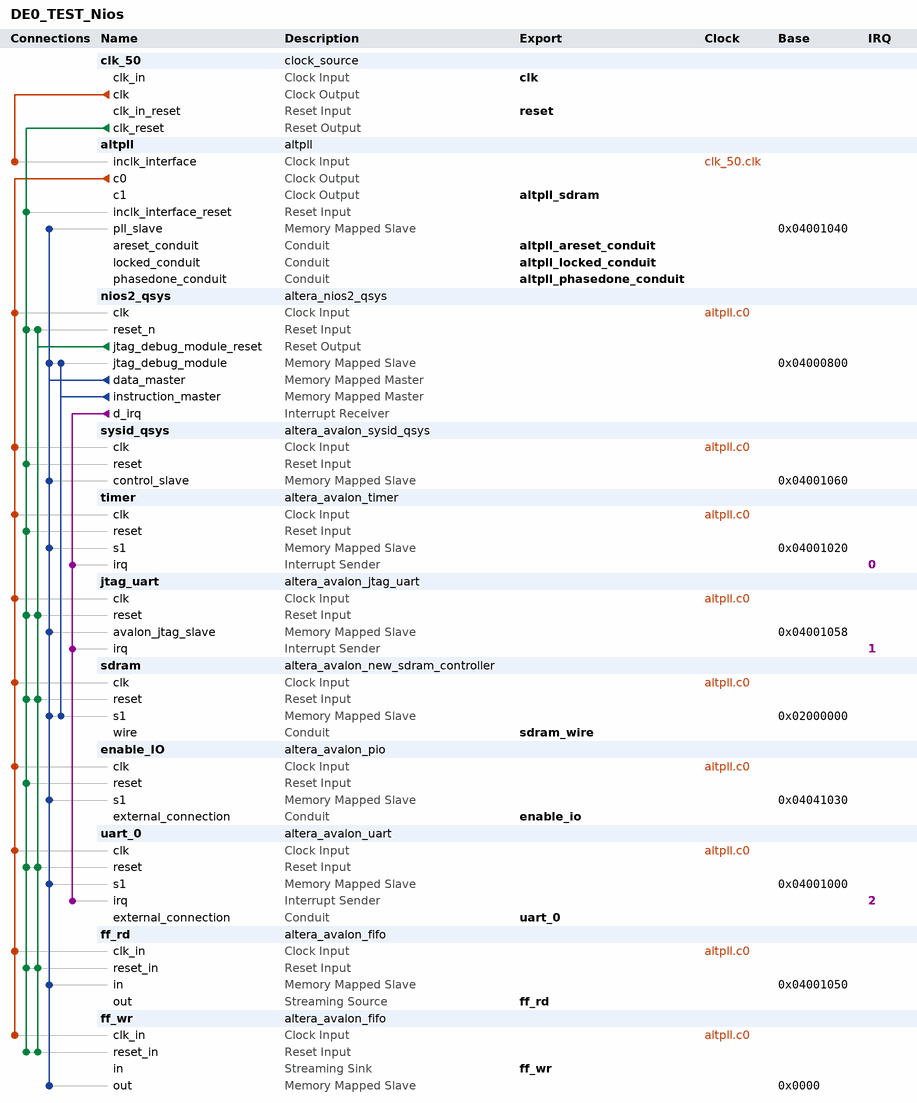
[diagram p0: system contents]
# Platform Designer (Qsys) system DE0_TEST_Nios, Cyclone IV E EP4CE22F17C6
# Parameters at their usual value, and those the tool derives, are not listed.
package require -exact qsys 13.0.1.99.2
create_system DE0_TEST_Nios
set_project_property DEVICE_FAMILY {Cyclone IV E}
set_project_property DEVICE EP4CE22F17C6

add_instance clk_50 clock_source 13.0
set_instance_parameter_value clk_50 clockFrequency 50000000

add_instance altpll altpll 13.0
set_instance_parameter_value altpll INCLK0_INPUT_FREQUENCY 20000
set_instance_parameter_value altpll CLK0_MULTIPLY_BY 2
set_instance_parameter_value altpll CLK1_MULTIPLY_BY 2
set_instance_parameter_value altpll CLK0_DIVIDE_BY 1
set_instance_parameter_value altpll CLK1_DIVIDE_BY 1
set_instance_parameter_value altpll CLK1_PHASE_SHIFT -1667
set_instance_parameter_value altpll CLK1_DUTY_CYCLE 50
set_instance_parameter_value altpll PORT_clk1 PORT_USED
set_instance_parameter_value altpll PORT_clk2 PORT_UNUSED
set_instance_parameter_value altpll PORT_clk3 PORT_UNUSED
set_instance_parameter_value altpll PORT_ARESET PORT_USED
set_instance_parameter_value altpll PORT_LOCKED PORT_USED

add_instance nios2_qsys altera_nios2_qsys 13.0
set_instance_parameter_value nios2_qsys resetSlave sdram.s1
set_instance_parameter_value nios2_qsys mmu_TLBMissExcSlave None
set_instance_parameter_value nios2_qsys exceptionSlave sdram.s1
set_instance_parameter_value nios2_qsys breakSlave nios2_qsys.jtag_debug_module
set_instance_parameter_value nios2_qsys impl Fast
set_instance_parameter_value nios2_qsys icache_size 4096

add_instance sysid_qsys altera_avalon_sysid_qsys 13.0
set_instance_parameter_value sysid_qsys id 0

add_instance timer altera_avalon_timer 13.0.1.99.2
set_instance_parameter_value timer period 1
set_instance_parameter_value timer periodUnits MSEC

add_instance jtag_uart altera_avalon_jtag_uart 13.0.1.99.2
set_instance_parameter_value jtag_uart simInteractiveOptions NO_INTERACTIVE_WINDOWS

add_instance sdram altera_avalon_new_sdram_controller 13.0.1.99.2
set_instance_parameter_value sdram TAC 5.5
set_instance_parameter_value sdram TRCD 20.0
set_instance_parameter_value sdram TRP 20.0
set_instance_parameter_value sdram casLatency 3
set_instance_parameter_value sdram columnWidth 9
set_instance_parameter_value sdram dataWidth 16
set_instance_parameter_value sdram generateSimulationModel true
set_instance_parameter_value sdram model single_Micron_MT48LC4M32B2_7_chip
set_instance_parameter_value sdram numberOfBanks 4
set_instance_parameter_value sdram numberOfChipSelects 1
set_instance_parameter_value sdram powerUpDelay 100.0
set_instance_parameter_value sdram refreshPeriod 15.625
set_instance_parameter_value sdram rowWidth 13

add_instance enable_IO altera_avalon_pio 13.0.1.99.2
set_instance_parameter_value enable_IO captureEdge true
set_instance_parameter_value enable_IO direction Output
set_instance_parameter_value enable_IO edgeType FALLING
set_instance_parameter_value enable_IO generateIRQ true
set_instance_parameter_value enable_IO irqType EDGE
set_instance_parameter_value enable_IO width 32

add_instance uart_0 altera_avalon_uart 13.0.1.99.2
set_instance_parameter_value uart_0 baud 115200
set_instance_parameter_value uart_0 dataBits 8
set_instance_parameter_value uart_0 fixedBaud true
set_instance_parameter_value uart_0 parity NONE
set_instance_parameter_value uart_0 stopBits 1

add_instance ff_rd altera_avalon_fifo 13.0.1.99.2
set_instance_parameter_value ff_rd bitsPerSymbol 32
set_instance_parameter_value ff_rd channelWidth 8
set_instance_parameter_value ff_rd errorWidth 8
set_instance_parameter_value ff_rd fifoDepth 32
set_instance_parameter_value ff_rd fifoInputInterfaceOptions AVALONMM_WRITE
set_instance_parameter_value ff_rd fifoOutputInterfaceOptions AVALONST_SOURCE
set_instance_parameter_value ff_rd singleClockMode true
set_instance_parameter_value ff_rd singleResetMode true
set_instance_parameter_value ff_rd symbolsPerBeat 1
set_instance_parameter_value ff_rd useIRQ false
set_instance_parameter_value ff_rd usePacket true
set_instance_parameter_value ff_rd useReadControl false
set_instance_parameter_value ff_rd useWriteControl false

add_instance ff_wr altera_avalon_fifo 13.0.1.99.2
set_instance_parameter_value ff_wr bitsPerSymbol 32
set_instance_parameter_value ff_wr channelWidth 8
set_instance_parameter_value ff_wr errorWidth 8
set_instance_parameter_value ff_wr fifoDepth 32
set_instance_parameter_value ff_wr fifoInputInterfaceOptions AVALONST_SINK
set_instance_parameter_value ff_wr fifoOutputInterfaceOptions AVALONMM_READ
set_instance_parameter_value ff_wr singleClockMode true
set_instance_parameter_value ff_wr singleResetMode true
set_instance_parameter_value ff_wr symbolsPerBeat 1
set_instance_parameter_value ff_wr useIRQ false
set_instance_parameter_value ff_wr usePacket true
set_instance_parameter_value ff_wr useReadControl false
set_instance_parameter_value ff_wr useWriteControl false

# connections
add_connection altpll.c0 enable_IO.clk clock
add_connection altpll.c0 ff_rd.clk_in clock
add_connection altpll.c0 ff_wr.clk_in clock
add_connection altpll.c0 jtag_uart.clk clock
add_connection altpll.c0 nios2_qsys.clk clock
add_connection altpll.c0 sdram.clk clock
add_connection altpll.c0 sysid_qsys.clk clock
add_connection altpll.c0 timer.clk clock
add_connection altpll.c0 uart_0.clk clock
add_connection clk_50.clk altpll.inclk_interface clock
add_connection clk_50.clk_reset altpll.inclk_interface_reset reset
add_connection clk_50.clk_reset enable_IO.reset reset
add_connection clk_50.clk_reset ff_rd.reset_in reset
add_connection clk_50.clk_reset ff_wr.reset_in reset
add_connection clk_50.clk_reset jtag_uart.reset reset
add_connection clk_50.clk_reset nios2_qsys.reset_n reset
add_connection clk_50.clk_reset sdram.reset reset
add_connection clk_50.clk_reset sysid_qsys.reset reset
add_connection clk_50.clk_reset timer.reset reset
add_connection clk_50.clk_reset uart_0.reset reset
add_connection nios2_qsys.jtag_debug_module_reset ff_rd.reset_in reset
add_connection nios2_qsys.jtag_debug_module_reset ff_wr.reset_in reset
add_connection nios2_qsys.jtag_debug_module_reset jtag_uart.reset reset
add_connection nios2_qsys.jtag_debug_module_reset nios2_qsys.reset_n reset
add_connection nios2_qsys.jtag_debug_module_reset sdram.reset reset
add_connection nios2_qsys.jtag_debug_module_reset uart_0.reset reset
add_connection nios2_qsys.data_master altpll.pll_slave avalon
set_connection_parameter_value nios2_qsys.data_master/altpll.pll_slave baseAddress 0x04001040
add_connection nios2_qsys.data_master enable_IO.s1 avalon
set_connection_parameter_value nios2_qsys.data_master/enable_IO.s1 baseAddress 0x04041030
add_connection nios2_qsys.data_master ff_rd.in avalon
set_connection_parameter_value nios2_qsys.data_master/ff_rd.in baseAddress 0x04001050
add_connection nios2_qsys.data_master ff_wr.out avalon
set_connection_parameter_value nios2_qsys.data_master/ff_wr.out baseAddress 0x0000
add_connection nios2_qsys.data_master jtag_uart.avalon_jtag_slave avalon
set_connection_parameter_value nios2_qsys.data_master/jtag_uart.avalon_jtag_slave baseAddress 0x04001058
add_connection nios2_qsys.data_master nios2_qsys.jtag_debug_module avalon
set_connection_parameter_value nios2_qsys.data_master/nios2_qsys.jtag_debug_module baseAddress 0x04000800
add_connection nios2_qsys.data_master sdram.s1 avalon
set_connection_parameter_value nios2_qsys.data_master/sdram.s1 baseAddress 0x02000000
add_connection nios2_qsys.data_master sysid_qsys.control_slave avalon
set_connection_parameter_value nios2_qsys.data_master/sysid_qsys.control_slave baseAddress 0x04001060
add_connection nios2_qsys.data_master timer.s1 avalon
set_connection_parameter_value nios2_qsys.data_master/timer.s1 baseAddress 0x04001020
add_connection nios2_qsys.data_master uart_0.s1 avalon
set_connection_parameter_value nios2_qsys.data_master/uart_0.s1 baseAddress 0x04001000
add_connection nios2_qsys.instruction_master nios2_qsys.jtag_debug_module avalon
set_connection_parameter_value nios2_qsys.instruction_master/nios2_qsys.jtag_debug_module baseAddress 0x04000800
add_connection nios2_qsys.instruction_master sdram.s1 avalon
set_connection_parameter_value nios2_qsys.instruction_master/sdram.s1 baseAddress 0x02000000
add_connection nios2_qsys.d_irq jtag_uart.irq interrupt
set_connection_parameter_value nios2_qsys.d_irq/jtag_uart.irq irqNumber 1
add_connection nios2_qsys.d_irq timer.irq interrupt
set_connection_parameter_value nios2_qsys.d_irq/timer.irq irqNumber 0
add_connection nios2_qsys.d_irq uart_0.irq interrupt
set_connection_parameter_value nios2_qsys.d_irq/uart_0.irq irqNumber 2

# exported interfaces
add_interface clk clock sink
set_interface_property clk EXPORT_OF clk_50.clk_in
add_interface reset reset sink
set_interface_property reset EXPORT_OF clk_50.clk_in_reset
add_interface sdram_wire conduit end
set_interface_property sdram_wire EXPORT_OF sdram.wire
add_interface altpll_sdram clock source
set_interface_property altpll_sdram EXPORT_OF altpll.c1
add_interface altpll_areset_conduit conduit end
set_interface_property altpll_areset_conduit EXPORT_OF altpll.areset_conduit
add_interface altpll_locked_conduit conduit end
set_interface_property altpll_locked_conduit EXPORT_OF altpll.locked_conduit
add_interface altpll_phasedone_conduit conduit end
set_interface_property altpll_phasedone_conduit EXPORT_OF altpll.phasedone_conduit
add_interface uart_0 conduit end
set_interface_property uart_0 EXPORT_OF uart_0.external_connection
add_interface ff_rd avalon_streaming source
set_interface_property ff_rd EXPORT_OF ff_rd.out
add_interface ff_wr avalon_streaming sink
set_interface_property ff_wr EXPORT_OF ff_wr.in
add_interface enable_io conduit end
set_interface_property enable_io EXPORT_OF enable_IO.external_connection

set_interconnect_requirement {$system} qsys_mm.clockCrossingAdapter HANDSHAKE
set_interconnect_requirement {$system} qsys_mm.maxAdditionalLatency 1

save_system DE0_TEST_Nios.qsys
